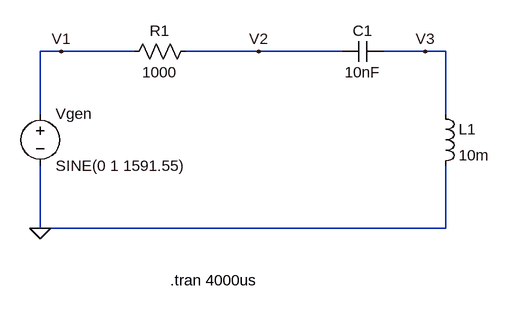
[diagram p0: schematic series_RLC.asc]
series_RLC.asc, the LTspice schematic file:
Version 4
SHEET 1 880 680
WIRE -560 -16 -592 -16
WIRE -448 -16 -560 -16
WIRE -256 -16 -368 -16
WIRE -128 -16 -256 -16
WIRE 0 -16 -64 -16
WIRE 32 -16 0 -16
WIRE -592 80 -592 -16
WIRE 32 80 32 -16
WIRE -592 256 -592 160
WIRE 32 256 32 160
WIRE 32 256 -592 256
FLAG -592 256 0
FLAG -560 -16 V1
FLAG -256 -16 V2
FLAG 0 -16 V3
SYMBOL voltage -592 64 R0
SYMATTR InstName Vgen
SYMATTR Value SINE(0 1 1591.55)
SYMBOL res -352 -32 R90
WINDOW 0 0 56 VBottom 2
WINDOW 3 32 56 VTop 2
SYMATTR InstName R1
SYMATTR Value 1000
SYMBOL cap -64 -32 R90
WINDOW 0 0 32 VBottom 2
WINDOW 3 32 32 VTop 2
SYMATTR InstName C1
SYMATTR Value 10nF
SYMBOL ind 16 64 R0
SYMATTR InstName L1
SYMATTR Value 10m
TEXT -392 336 Left 2 !.tran 4000us

The netlist it stands for:
* series_RLC.asc
Vgen V1 0 SINE(0 1 1591.55)
R1 V2 V1 1000
C1 V3 V2 10nF
L1 V3 0 10m
.tran 4000us
.backanno
.end